# Altium schematic sheet PDMC-S02-V00-SPOC.SchDoc: SPOC
size A3; DrawnBy: Zoe Goodward; Organization: QUT Motorsport; Address1: O-120, Gardens Point; Address2: 2 George Street; Address3: Brisbane, QLD 4000; Address4: Australia; DocumentNumber: 2; Revision: 01; SheetNumber: 2; SheetTotal: 6; Version: 01; Project: Power Distribution Module Card; PageSetup: Record=PageOptions|CenterHorizontal=True|CenterVertical=True|PrintScale=0.97|XCorrection=1.00|YCorrection=1.00|PrintKind=0|BorderSize=5000000|LeftOffset=0|BottomOffset=0|Orientation=2|PaperLength=1000|PaperWidth=1000|Scale=100|PaperSource=7|PrintQuality=-4|MediaType=1|DitherType=10|PaperKind=A4|PrintScaleMode=1
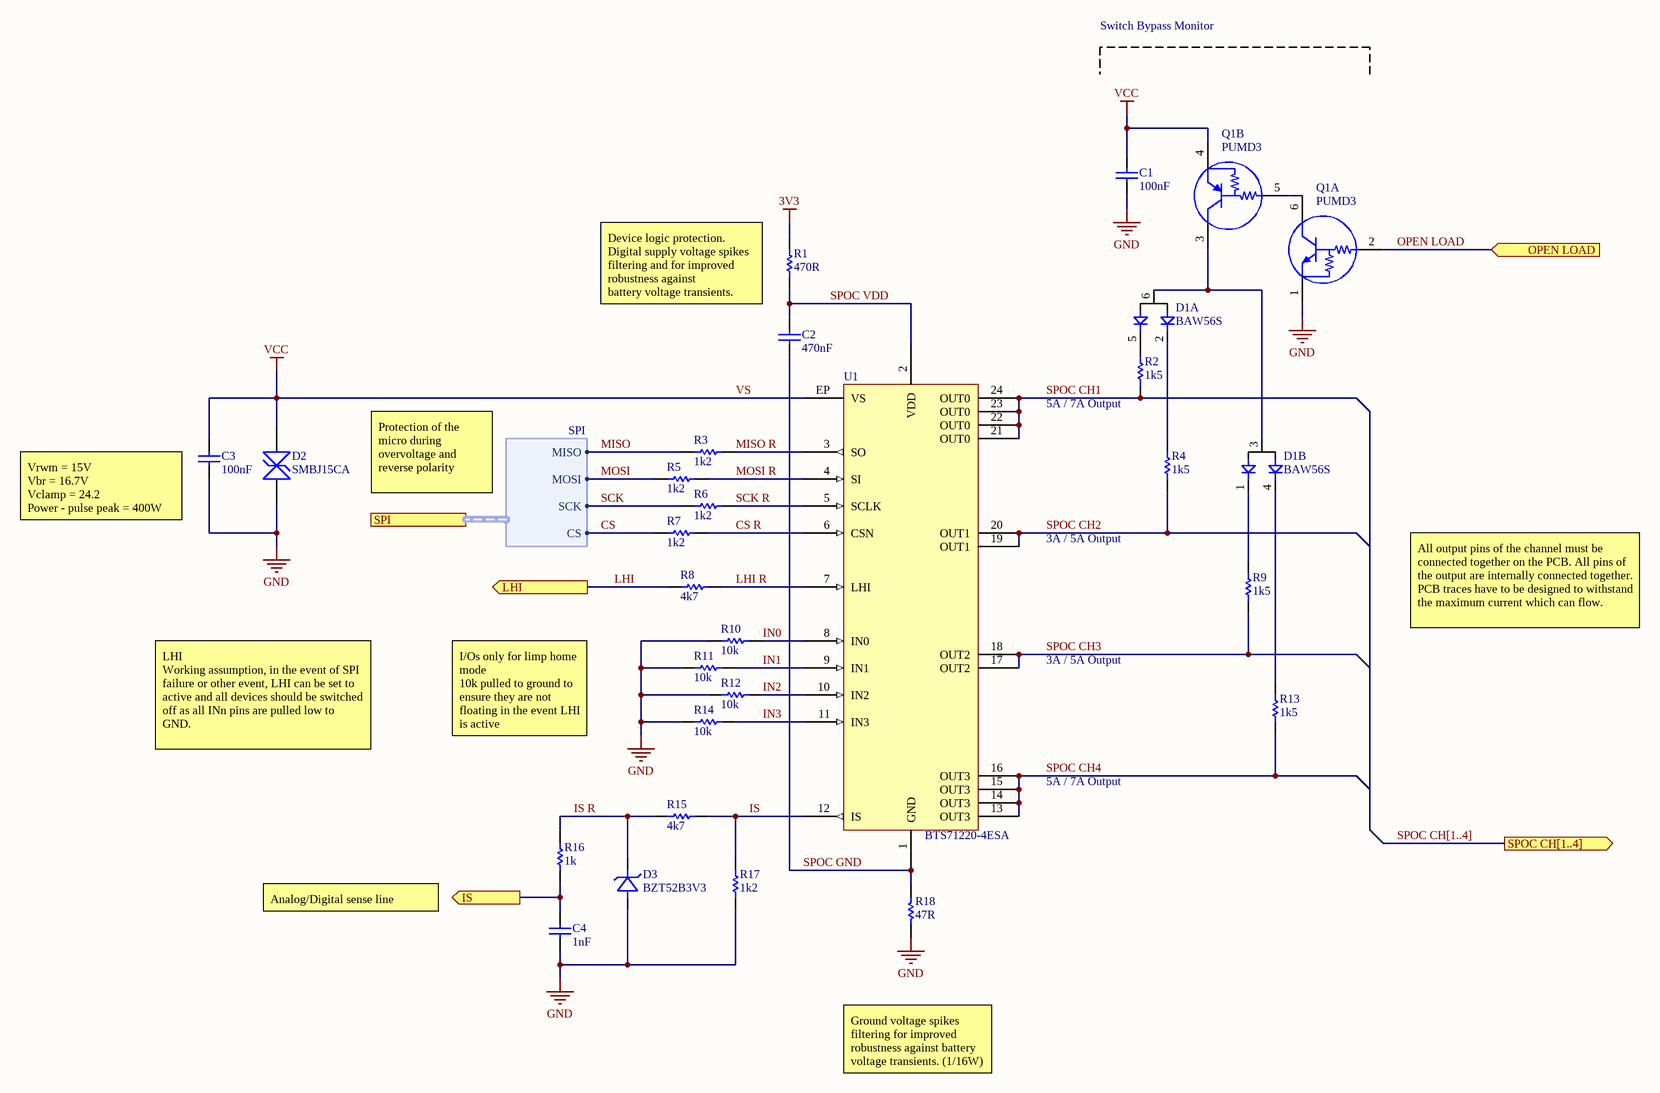
[diagram p0: PDMC-S02-V00-SPOC.SchDoc]

## Parts
C1  100nF  [Cap_Ceramic_0603]
C2  470nF  [Cap_Ceramic_0603]
C3  100nF  [Cap_Ceramic_0603]
C4  1nF  [Cap_Ceramic_0603]
D1  BAW56S  [TSSOP6]  (parts A,B of 2)
D2  SMBJ15CA  [DO-214AA]
D3  BZT52B3V3  [SOD123]
Q1  PUMD3  [TSSOP6]  (parts A,B of 2)
R1  470R  [Res_ThinFilm_1210]
R2  1k5  [Res_ThinFilm_0603]
R3  1k2  [Res_ThinFilm_0603]
R4  1k5  [Res_ThinFilm_0603]
R5  1k2  [Res_ThinFilm_0603]
R6  1k2  [Res_ThinFilm_0603]
R7  1k2  [Res_ThinFilm_0603]
R8  4k7  [Res_ThinFilm_0603]
R9  1k5  [Res_ThinFilm_0603]
R10  10k  [Res_ThinFilm_0603]
R11  10k  [Res_ThinFilm_0603]
R12  10k  [Res_ThinFilm_0603]
R13  1k5  [Res_ThinFilm_0603]
R14  10k  [Res_ThinFilm_0603]
R15  4k7  [Res_ThinFilm_0603]
R16  1k  [Res_ThinFilm_0603]
R17  1k2  [Res_ThinFilm_0603]
R18  47R  [Res_ThinFilm_0603]
U1  BTS71220-4ESA  [PG-TSDO-24-32]

## Ports
IS (out), LHI (out), OPEN LOAD (in), SPI (harness SPI), SPOC CH[1..4] (out)

## Harnesses
SPI: MOSI, MISO, SCK, CS

## Nets
3V3: R1.2
GND: C1.1 C3.1 C4.1 D2.1 D3.A(Anode) Q1.1(E1) R10.1 R11.1 R12.1 R14.1 R17.1 R18.1
VS: C1.2 C3.2 D2.2 Q1.4(E2) U1.EP(VS)  [also labelled VCC]
CS: R7.1 ; port SPI.CS
CS R: R7.2 U1.6(CSN)
IN0: R10.2 U1.8(IN0)
IN1: R11.2 U1.9(IN1)
IN2: R12.2 U1.10(IN2)
IN3: R14.2 U1.11(IN3)
IS: R15.2 R17.2 U1.12(IS)
IS: C4.2 R16.1 ; port IS  [a separate net that carries the same name]
IS R: D3.K(Cathode) R15.1 R16.2
LHI: R8.1 ; port LHI
LHI R: R8.2 U1.7(LHI)
MISO: R3.1 ; port SPI.MISO
MISO R: R3.2 U1.3(SO)
MOSI: R5.1 ; port SPI.MOSI
MOSI R: R5.2 U1.4(SI)
OPEN LOAD: Q1.2(B1) ; port OPEN LOAD
SCK: R6.1 ; port SPI.SCK
SCK R: R6.2 U1.5(SCLK)
SPOC CH1: R2.1 U1.21(OUT0) U1.22(OUT0) U1.23(OUT0) U1.24(OUT0)
SPOC CH2: R4.1 U1.19(OUT1) U1.20(OUT1)
SPOC CH3: R9.1 U1.17(OUT2) U1.18(OUT2)
SPOC CH4: R13.1 U1.13(OUT3) U1.14(OUT3) U1.15(OUT3) U1.16(OUT3)
SPOC GND: C2.1 R18.2 U1.1(GND)
SPOC VDD: C2.2 R1.1 U1.2(VDD)
NetD1_1: D1.1 R9.2
NetD1_2: D1.2 R4.2
NetD1_3: D1.3 D1.6 Q1.3(C2)
NetD1_4: D1.4 R13.2
NetD1_5: D1.5 R2.2
NetQ1_5: Q1.5(B2) Q1.6(C1)

## Buses and harness runs
bus SPOC CH[1..4] = port SPOC CH[1..4]

## Notes on the sheet
- Switch Bypass Monitor
- Device logic protection.
  Digital supply voltage spikes filtering and for improved robustness against
  battery voltage transients.
- (near R2) 5A / 7A Output
- (near C3) Vrwm = 15V
  Vbr = 16.7V
  Vclamp = 24.2
  Power - pulse peak = 400W
- Protection of the micro during overvoltage and reverse polarity
- 3A / 5A Output
- All output pins of the channel must be connected together on the PCB. All pins of the output are internally connected together.
  PCB traces have to be designed to withstand the maximum current which can flow.
- I/Os only for limp home mode
  10k pulled to ground to ensure they are not floating in the event LHI is active
- LHI
  Working assumption, in the event of SPI failure or other event, LHI can be set to active and all devices should be switched off as all INn pins are pulled low to GND.
- 5A / 7A Output
- Analog/Digital sense line
- Ground voltage spikes filtering for improved robustness against battery voltage transients. (1/16W)
- Revision History:
- Sheet Title:
- Rev
- Date
- Description
- Project:
- Size:
- Drawn By:
- A3
- Number:
- Revision:
- Sheet
- Version:
- of
- QUT Motorsport
- O-120, Gardens Point
- 2 George Street
- Brisbane, QLD 4000
- Australia
- Print Date:
- Print Time:
- File Name:

## Library data of the parts
C1 C3 = 100nF 50V 5% X7R 0603: Capacitor, Ceramic, SMD, 100nF, 50V, 5%, X7R, 0603
C2 = 470nF 50V 5% X7R 0603: Capacitor, Ceramic, SMD, 470nF, 50V, 5%, X7R, 0603
C4 = 1nF 50V 5% X7R 0603: Capacitor, Ceramic, SMD, 1nF, 25V, 5%, X7R, 0603
D1 = BAW56S: Diode Array 2 Pair Common Anode Standard 90V 250mA (DC) Surface Mount 6-TSSOP, SC-88, SOT-363; ComponentLink1Description: Digikey; ComponentLink1URL: https://www.digikey.com.au/product-detail/en/nexperia-usa-inc/BAW56S-115/1727-4833-1-ND/2531320; ComponentLink2Description: Datasheet; ComponentLink2URL: https://assets.nexperia.com/documents/data-sheet/BAV756S_BAW56_SER.pdf
D2 = SMBJ15CA: Diode, SMD, TVS, 15V, 24.4V, 24.6A Ipp, DO-214AA; ComponentLink1Description: Datasheet; ComponentLink1URL: https://www.littelfuse.com/~/media/electronics/datasheets/tvs_diodes/littelfuse_tvs_diode_smbj_datasheet.pdf.pdf; ComponentLink2Description: Digikey; ComponentLink2URL: https://www.digikey.com.au/product-detail/en/littelfuse-inc/SMBJ15CA/SMBJ15CALFCT-ND/285983
D3 = BZT52B3V3: Diode, SMD, Zener, 3.3V, 2%, 410mW, SOD-123; ComponentLink1Description: Datasheet; ComponentLink1URL: https://www.vishay.com/docs/85760/bzt52.pdf; ComponentLink2Description: Digikey; ComponentLink2URL: https://www.digikey.com/product-detail/en/vishay-semiconductor-diodes-division/BZT52B3V3-E3-08/112-BZT52B3V3-E3-08CT-ND/8564806
Q1 = PUMD3: Pre-Biased Bipolar Transistor (BJT) 1 NPN, 1 PNP - Pre-Biased (Dual) 50V 100mA 300mW Surface Mount 6-TSSOP; ComponentLink1Description: Datasheet; ComponentLink1URL: https://assets.nexperia.com/documents/data-sheet/PEMD3_PIMD3_PUMD3.pdf; ComponentLink2Description: Digikey; ComponentLink2URL: https://www.digikey.com.au/product-detail/en/nexperia-usa-inc/PUMD3-165/1727-1984-1-ND/5221957
R1 = 470R 5% 1210: Resistor, SMD, 470R, 0.25W, 5%, 1210
R2 R4 R9 R13 = 1k5 5% 0603: Resistor, SMD, 1k5, 0.1W, 5%, 0603
R3 R5-R7 R17 = 1k2 5% 0603: Resistor, SMD, 1k2, 0.1W, 5%, 0603
R8 R15 = 4k7 5% 0603: Resistor, SMD, 4k7, 0.1W, 5%, 0603
R10-R12 R14 = 10k 5% 0603: Resistor, SMD, 10k, 0.1W, 5%, 0603
R16 = 1k 5% 0603: Resistor, SMD, 1k, 0.1W, 5%, 0603
R18 = 47R 5% 0603: Resistor, SMD, 47R, 0.1W, 5%, 0603
U1 = BTS71220-4ESA: The BTS71220-4ESA is a SPI Power Controller, providing protection functions and diagnosis. The device is integrated in SMART7 technology.; ComponentLink1Description: Datasheet; ComponentLink1URL: https://www.infineon.com/dgdl/Infineon-BTS71220-4ESA-DS-v01_00-EN.pdf?fileId=5546d462636cc8fb0163feaaf85408d1; ComponentLink2Description: Digikey; ComponentLink2URL: https://www.digikey.com.au/product-detail/en/infineon-technologies/BTS712204ESAXUMA1/BTS712204ESAXUMA1CT-ND/9678741